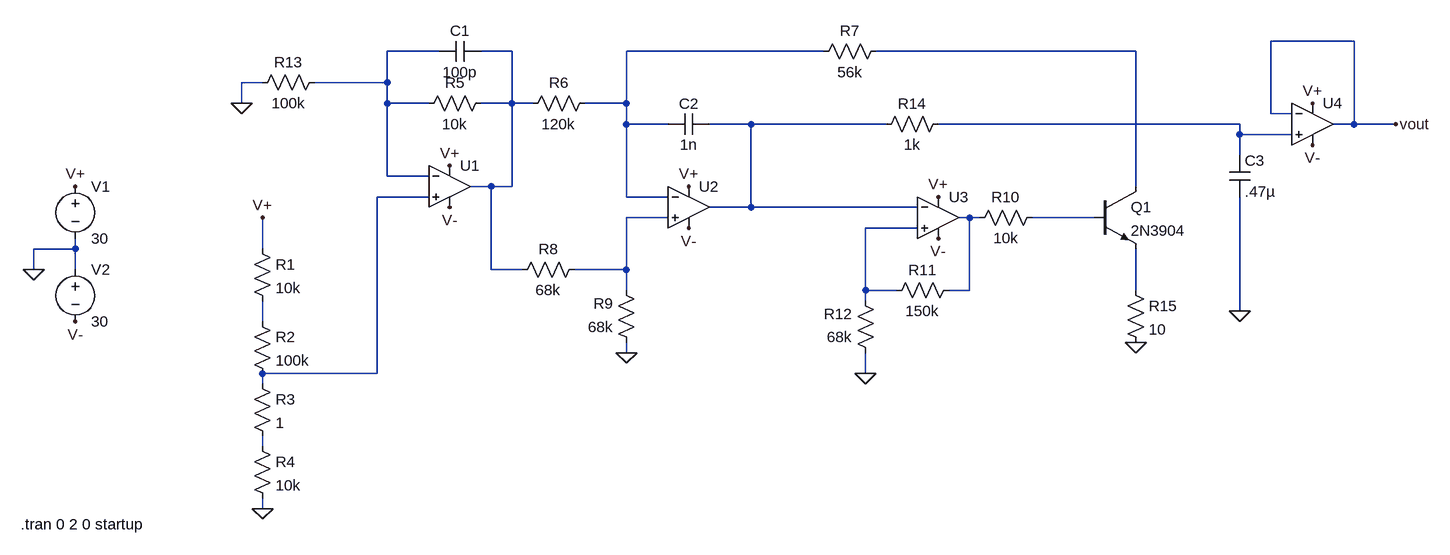
[diagram p0: schematic vco.asc]
vco.asc, the LTspice schematic file:
Version 4
SHEET 1 2080 680
WIRE 1936 -160 1808 -160
WIRE 528 -144 448 -144
WIRE 640 -144 592 -144
WIRE 1120 -144 816 -144
WIRE 1600 -144 1200 -144
WIRE 256 -96 224 -96
WIRE 448 -96 448 -144
WIRE 448 -96 336 -96
WIRE 224 -64 224 -96
WIRE 448 -64 448 -96
WIRE 512 -64 448 -64
WIRE 640 -64 640 -144
WIRE 640 -64 592 -64
WIRE 672 -64 640 -64
WIRE 816 -64 816 -144
WIRE 816 -64 752 -64
WIRE 1808 -48 1808 -160
WIRE 1840 -48 1808 -48
WIRE 816 -32 816 -64
WIRE 880 -32 816 -32
WIRE 1008 -32 944 -32
WIRE 1216 -32 1008 -32
WIRE 1760 -32 1296 -32
WIRE 1936 -32 1936 -160
WIRE 1936 -32 1904 -32
WIRE 2000 -32 1936 -32
WIRE 1760 -16 1760 -32
WIRE 1840 -16 1760 -16
WIRE 1760 16 1760 -16
WIRE 448 48 448 -64
WIRE 512 48 448 48
WIRE 608 64 576 64
WIRE 640 64 640 -64
WIRE 640 64 608 64
WIRE 1600 64 1600 -144
WIRE 512 80 432 80
WIRE 816 80 816 -32
WIRE 880 80 816 80
WIRE 1008 96 1008 -32
WIRE 1008 96 944 96
WIRE 1264 96 1008 96
WIRE 880 112 816 112
WIRE 1344 112 1328 112
WIRE 1360 112 1344 112
WIRE 1536 112 1440 112
WIRE 1264 128 1184 128
WIRE -32 160 -32 144
WIRE -32 160 -96 160
WIRE 256 160 256 112
WIRE -96 192 -96 160
WIRE -32 192 -32 160
WIRE 608 192 608 64
WIRE 656 192 608 192
WIRE 816 192 816 112
WIRE 816 192 736 192
WIRE 816 224 816 192
WIRE 1184 224 1184 128
WIRE 1232 224 1184 224
WIRE 1344 224 1344 112
WIRE 1344 224 1312 224
WIRE 1600 224 1600 160
WIRE 1184 240 1184 224
WIRE 1760 256 1760 80
WIRE 256 272 256 240
WIRE 816 320 816 304
WIRE 432 352 432 80
WIRE 432 352 256 352
WIRE 1184 352 1184 320
WIRE 256 368 256 352
WIRE 256 464 256 448
WIRE 256 560 256 544
FLAG -96 192 0
FLAG -32 272 V-
FLAG -32 64 V+
FLAG 544 32 V+
FLAG 912 64 V+
FLAG 1296 80 V+
FLAG 544 96 V-
FLAG 912 128 V-
FLAG 1296 144 V-
FLAG 256 560 0
FLAG 256 112 V+
FLAG 816 320 0
FLAG 1184 352 0
FLAG 224 -64 0
FLAG 1872 -64 V+
FLAG 1872 0 V-
FLAG 1760 256 0
FLAG 2000 -32 vout
FLAG 1600 304 0
SYMBOL voltage -32 48 R0
WINDOW 123 0 0 Left 2
WINDOW 39 0 0 Left 2
SYMATTR InstName V1
SYMATTR Value 30
SYMBOL voltage -32 176 R0
WINDOW 123 0 0 Left 2
WINDOW 39 0 0 Left 2
SYMATTR InstName V2
SYMATTR Value 30
SYMBOL Opamps\\UniversalOpamp2 544 64 R0
SYMATTR InstName U1
SYMBOL Opamps\\UniversalOpamp2 912 96 R0
SYMATTR InstName U2
SYMBOL Opamps\\UniversalOpamp2 1296 112 R0
SYMATTR InstName U3
SYMBOL res 240 144 R0
SYMATTR InstName R1
SYMATTR Value 10k
SYMBOL res 240 256 R0
SYMATTR InstName R2
SYMATTR Value 100k
SYMBOL res 240 352 R0
SYMATTR InstName R3
SYMATTR Value 1
SYMBOL res 240 448 R0
SYMATTR InstName R4
SYMATTR Value 10k
SYMBOL res 608 -80 R90
WINDOW 0 0 56 VBottom 2
WINDOW 3 32 56 VTop 2
SYMATTR InstName R5
SYMATTR Value 10k
SYMBOL cap 592 -160 R90
WINDOW 0 0 32 VBottom 2
WINDOW 3 32 32 VTop 2
SYMATTR InstName C1
SYMATTR Value 100p
SYMBOL res 768 -80 R90
WINDOW 0 0 56 VBottom 2
WINDOW 3 32 56 VTop 2
SYMATTR InstName R6
SYMATTR Value 120k
SYMBOL res 752 176 R90
WINDOW 0 0 56 VBottom 2
WINDOW 3 32 56 VTop 2
SYMATTR InstName R8
SYMATTR Value 68k
SYMBOL res 832 320 R180
WINDOW 0 36 76 Left 2
WINDOW 3 36 40 Left 2
SYMATTR InstName R9
SYMATTR Value 68k
SYMBOL cap 944 -48 R90
WINDOW 0 0 32 VBottom 2
WINDOW 3 32 32 VTop 2
SYMATTR InstName C2
SYMATTR Value 1n
SYMBOL res 1216 -160 R90
WINDOW 0 0 56 VBottom 2
WINDOW 3 32 56 VTop 2
SYMATTR InstName R7
SYMATTR Value 56k
SYMBOL npn 1536 64 R0
SYMATTR InstName Q1
SYMATTR Value 2N3904
SYMBOL res 1456 96 R90
WINDOW 0 0 56 VBottom 2
WINDOW 3 32 56 VTop 2
SYMATTR InstName R10
SYMATTR Value 10k
SYMBOL res 1328 208 R90
WINDOW 0 0 56 VBottom 2
WINDOW 3 32 56 VTop 2
SYMATTR InstName R11
SYMATTR Value 150k
SYMBOL res 1200 336 R180
WINDOW 0 36 76 Left 2
WINDOW 3 36 40 Left 2
SYMATTR InstName R12
SYMATTR Value 68k
SYMBOL res 352 -112 R90
WINDOW 0 0 56 VBottom 2
WINDOW 3 32 56 VTop 2
SYMATTR InstName R13
SYMATTR Value 100k
SYMBOL res 1312 -48 R90
WINDOW 0 0 56 VBottom 2
WINDOW 3 32 56 VTop 2
SYMATTR InstName R14
SYMATTR Value 1k
SYMBOL cap 1744 16 R0
SYMATTR InstName C3
SYMATTR Value .47µ
SYMBOL Opamps\\UniversalOpamp2 1872 -32 R0
SYMATTR InstName U4
SYMBOL res 1584 208 R0
SYMATTR InstName R15
SYMATTR Value 10
TEXT -116 584 Left 2 !.tran 0 2 0 startup

The netlist it stands for:
* vco.asc
V1 V+ 0 30
V2 0 V- 30
XU1 N007 N001 V+ V- N002 level.2 Avol=1Meg GBW=10Meg Slew=10Meg ilimit=25m rail=0 Vos=0 phimargin=45 en=0 enk=0 in=0 ink=0 Rin=500Meg  ; pins IN+ IN- V+ V- OUT
XU2 N008 N003 V+ V- N005 level.2 Avol=1Meg GBW=10Meg Slew=10Meg ilimit=25m rail=0 Vos=0 phimargin=45 en=0 enk=0 in=0 ink=0 Rin=500Meg  ; pins IN+ IN- V+ V- OUT
XU3 N011 N005 V+ V- N009 level.2 Avol=1Meg GBW=10Meg Slew=10Meg ilimit=25m rail=0 Vos=0 phimargin=45 en=0 enk=0 in=0 ink=0 Rin=500Meg  ; pins IN+ IN- V+ V- OUT
R1 V+ N013 10k
R2 N013 N007 100k
R3 N007 N014 1
R4 N014 0 10k
R5 N002 N001 10k
C1 N002 N001 100p
R6 N003 N002 120k
R8 N008 N002 68k
R9 0 N008 68k
C2 N005 N003 1n
R7 N004 N003 56k
Q1 N004 N010 N012 0 2N3904
R10 N010 N009 10k
R11 N009 N011 150k
R12 0 N011 68k
R13 N001 0 100k
R14 N006 N005 1k
C3 N006 0 .47µ
XU4 N006 vout V+ V- vout level.2 Avol=1Meg GBW=10Meg Slew=10Meg ilimit=25m rail=0 Vos=0 phimargin=45 en=0 enk=0 in=0 ink=0 Rin=500Meg  ; pins IN+ IN- V+ V- OUT
R15 N012 0 10
.model NPN NPN
.model PNP PNP
.lib standard.bjt
.tran 0 2 0 startup
.lib UniversalOpamps2.sub
.backanno
.end